# Altium schematic sheet IMX8_INPUT.SchDoc
size 594 x 420 mm; SheetNumber: 9; SheetTotal: 12
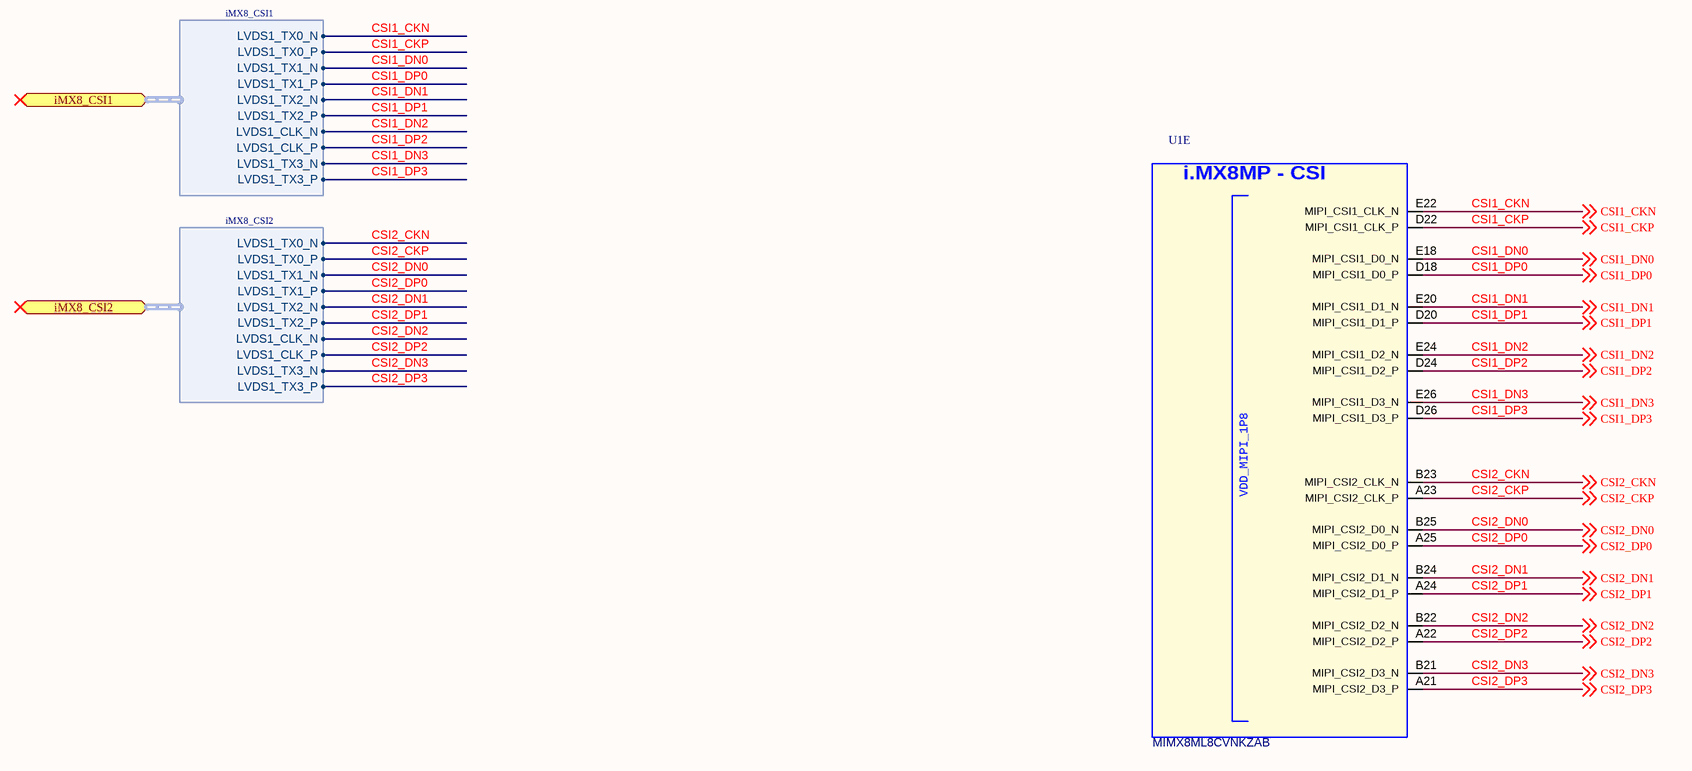
[diagram p0: IMX8_INPUT.SchDoc]

## Parts
U1  MIMX8ML8CVNKZAB  [BGA548C50P29X29_1500X1500X148]  (part E of 15)

## Ports
iMX8_CSI1 (bidir, harness iMX8_CSI1), iMX8_CSI2 (bidir, harness iMX8_CSI2)

## Harnesses
iMX8_CSI1: LVDS1_TX0_N, LVDS1_TX0_P, LVDS1_TX1_N, LVDS1_TX1_P, LVDS1_TX2_N, LVDS1_TX2_P, LVDS1_CLK_N, LVDS1_CLK_P, LVDS1_TX3_N, LVDS1_TX3_P
iMX8_CSI2: LVDS1_TX0_N, LVDS1_TX0_P, LVDS1_TX1_N, LVDS1_TX1_P, LVDS1_TX2_N, LVDS1_TX2_P, LVDS1_CLK_N, LVDS1_CLK_P, LVDS1_TX3_N, LVDS1_TX3_P

## Nets
CSI1_CKN: U1.E22(MIPI_CSI1_CLK_N) ; off-sheet CSI1_CKN, port iMX8_CSI1.LVDS1_TX0_N
CSI1_CKP: U1.D22(MIPI_CSI1_CLK_P) ; off-sheet CSI1_CKP, port iMX8_CSI1.LVDS1_TX0_P
CSI1_DN0: U1.E18(MIPI_CSI1_D0_N) ; off-sheet CSI1_DN0, port iMX8_CSI1.LVDS1_TX1_N
CSI1_DN1: U1.E20(MIPI_CSI1_D1_N) ; off-sheet CSI1_DN1, port iMX8_CSI1.LVDS1_TX2_N
CSI1_DN2: U1.E24(MIPI_CSI1_D2_N) ; off-sheet CSI1_DN2, port iMX8_CSI1.LVDS1_CLK_N
CSI1_DN3: U1.E26(MIPI_CSI1_D3_N) ; off-sheet CSI1_DN3, port iMX8_CSI1.LVDS1_TX3_N
CSI1_DP0: U1.D18(MIPI_CSI1_D0_P) ; off-sheet CSI1_DP0, port iMX8_CSI1.LVDS1_TX1_P
CSI1_DP1: U1.D20(MIPI_CSI1_D1_P) ; off-sheet CSI1_DP1, port iMX8_CSI1.LVDS1_TX2_P
CSI1_DP2: U1.D24(MIPI_CSI1_D2_P) ; off-sheet CSI1_DP2, port iMX8_CSI1.LVDS1_CLK_P
CSI1_DP3: U1.D26(MIPI_CSI1_D3_P) ; off-sheet CSI1_DP3, port iMX8_CSI1.LVDS1_TX3_P
CSI2_CKN: U1.B23(MIPI_CSI2_CLK_N) ; off-sheet CSI2_CKN, port iMX8_CSI2.LVDS1_TX0_N
CSI2_CKP: U1.A23(MIPI_CSI2_CLK_P) ; off-sheet CSI2_CKP, port iMX8_CSI2.LVDS1_TX0_P
CSI2_DN0: U1.B25(MIPI_CSI2_D0_N) ; off-sheet CSI2_DN0, port iMX8_CSI2.LVDS1_TX1_N
CSI2_DN1: U1.B24(MIPI_CSI2_D1_N) ; off-sheet CSI2_DN1, port iMX8_CSI2.LVDS1_TX2_N
CSI2_DN2: U1.B22(MIPI_CSI2_D2_N) ; off-sheet CSI2_DN2, port iMX8_CSI2.LVDS1_CLK_N
CSI2_DN3: U1.B21(MIPI_CSI2_D3_N) ; off-sheet CSI2_DN3, port iMX8_CSI2.LVDS1_TX3_N
CSI2_DP0: U1.A25(MIPI_CSI2_D0_P) ; off-sheet CSI2_DP0, port iMX8_CSI2.LVDS1_TX1_P
CSI2_DP1: U1.A24(MIPI_CSI2_D1_P) ; off-sheet CSI2_DP1, port iMX8_CSI2.LVDS1_TX2_P
CSI2_DP2: U1.A22(MIPI_CSI2_D2_P) ; off-sheet CSI2_DP2, port iMX8_CSI2.LVDS1_CLK_P
CSI2_DP3: U1.A21(MIPI_CSI2_D3_P) ; off-sheet CSI2_DP3, port iMX8_CSI2.LVDS1_TX3_P

## Notes on the sheet
- DWG NO:
- REV:
- THIS DOCUMENT AND THE DATA DISCLOSED HEREIN OR
- HEREWITH IS THE PROPERTY OF ALTIUM LIMITED AND MAY
- BE FREELY DISTRIBUTED IN WHOLE. NO RIGHTS ARE
- RESERVED OR EXPRESS OR IMPLIED WARANTEE GIVEN.
- REVISION
- DESCRIPTION
- DATE
- APPROVED
- ENG:
- APPROVALS
- PROJECT
- DSN:
- CHK:
- REFERENCE DOCUMENTS
- PROJECT REVISION:
- TITLE
- DOCUMENT REVISION:
- DESIGN ITEM:
- BOM:
- FAB DWG:
- PCB DWG:
- ASSY DWG:
- SCALE:
- A2
- SIZE
- CAGE CODE
- FILE NAME
- DWG NO.
- SHEET
- OF
- REV
- (in symbol CMP-001-000983-8, part E) i.MX8MP - CSI

## Library data of the parts
U1 = CMP-001-000983-8: CPU QUAD CORTEX A53+M4 1.6GHZ BGA548 Industrial; Manufacturer: NXP Semiconductors; Sort order: 501; System: IC; ComponentLink1Description: 1_Datasheet; ComponentLink1URL: https://www.nxp.com/part/MIMX8ML8CVNKZAB#/; ComponentLink2Description: 2_Product page; ComponentLink3Description: 3_X-information; ComponentLink4Description: 4_X-information; Creation date: 20240524; Dimensions WxLxH: 15 x 15 x 1.33mm; Operating temperature range: -40... +105 °C; Package: FCBGA548; Part Number: MIMX8ML8CVNKZAB; ClassName: BIG; Source: UUDET_KOMPONENTIT.SchLib; Design Item ID: MIMX8ML8CVNKZAB; Manufacturer Part Number: MIMX8ML8CVNKZAB; Component Type: Processor